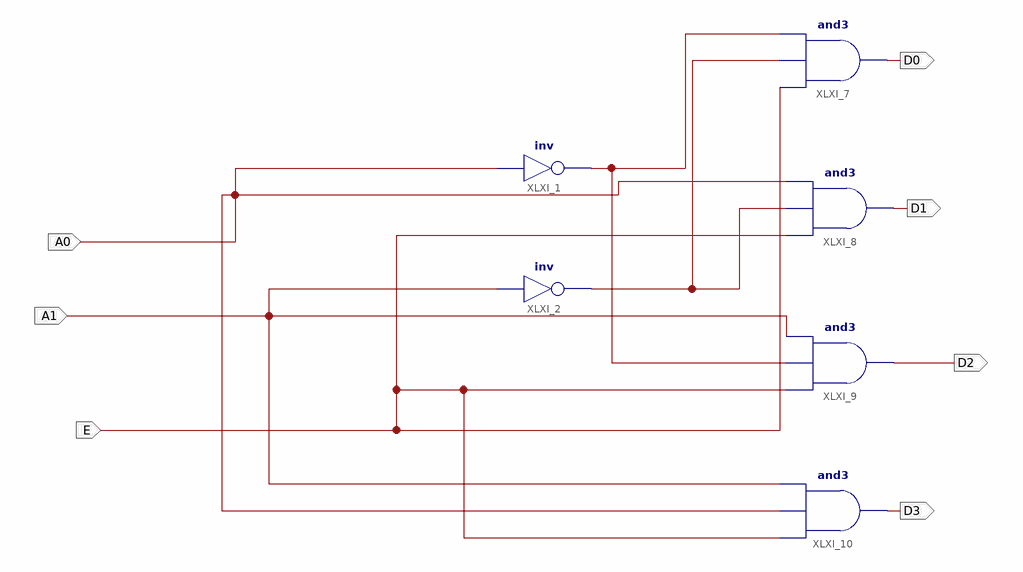
[diagram p0: schematic sheet 1]
// Xilinx ISE schematic D2_4E.sch (kintex7) as structural Verilog: 6 symbols, 7 ports
module D2_4E (
  input  A0,
  input  A1,
  input  E,
  output D0,
  output D1,
  output D2,
  output D3
);

  wire XLXN_7, XLXN_9;

  not XLXI_1 (XLXN_9, A0);
  not XLXI_2 (XLXN_7, A1);
  and XLXI_7 (D0, E, XLXN_7, XLXN_9);
  and XLXI_8 (D1, E, XLXN_7, A0);
  and XLXI_9 (D2, E, XLXN_9, A1);
  and XLXI_10 (D3, E, A0, A1);
endmodule
